# EAGLE design Plytka_AVR (EAGLE 8.2.1)
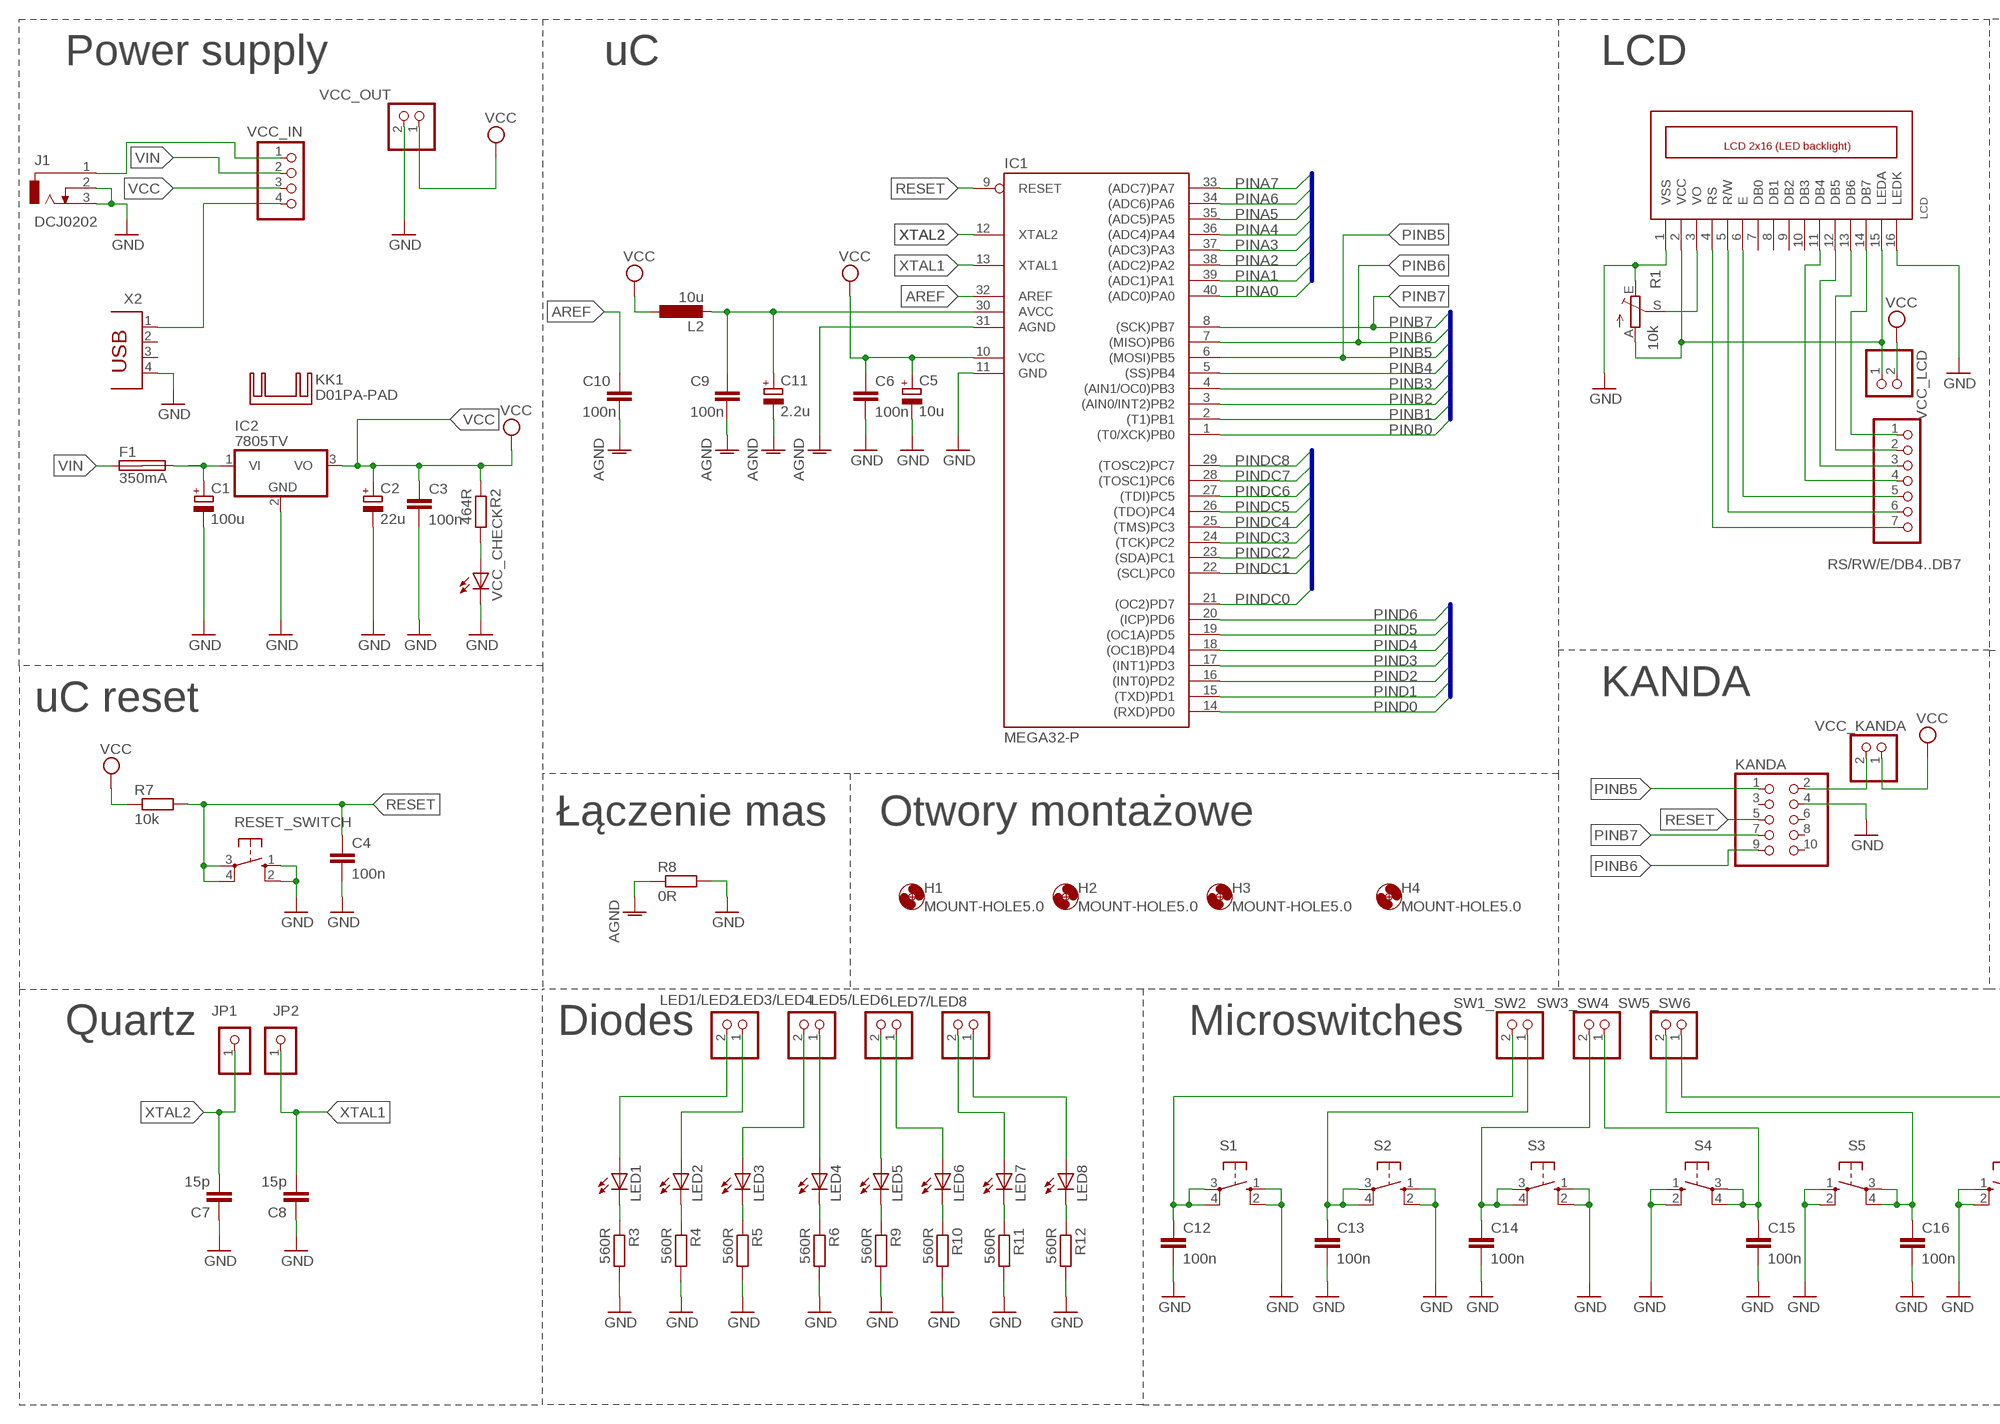
[diagram p0: schematic, sheet 1, part 1 of 2]
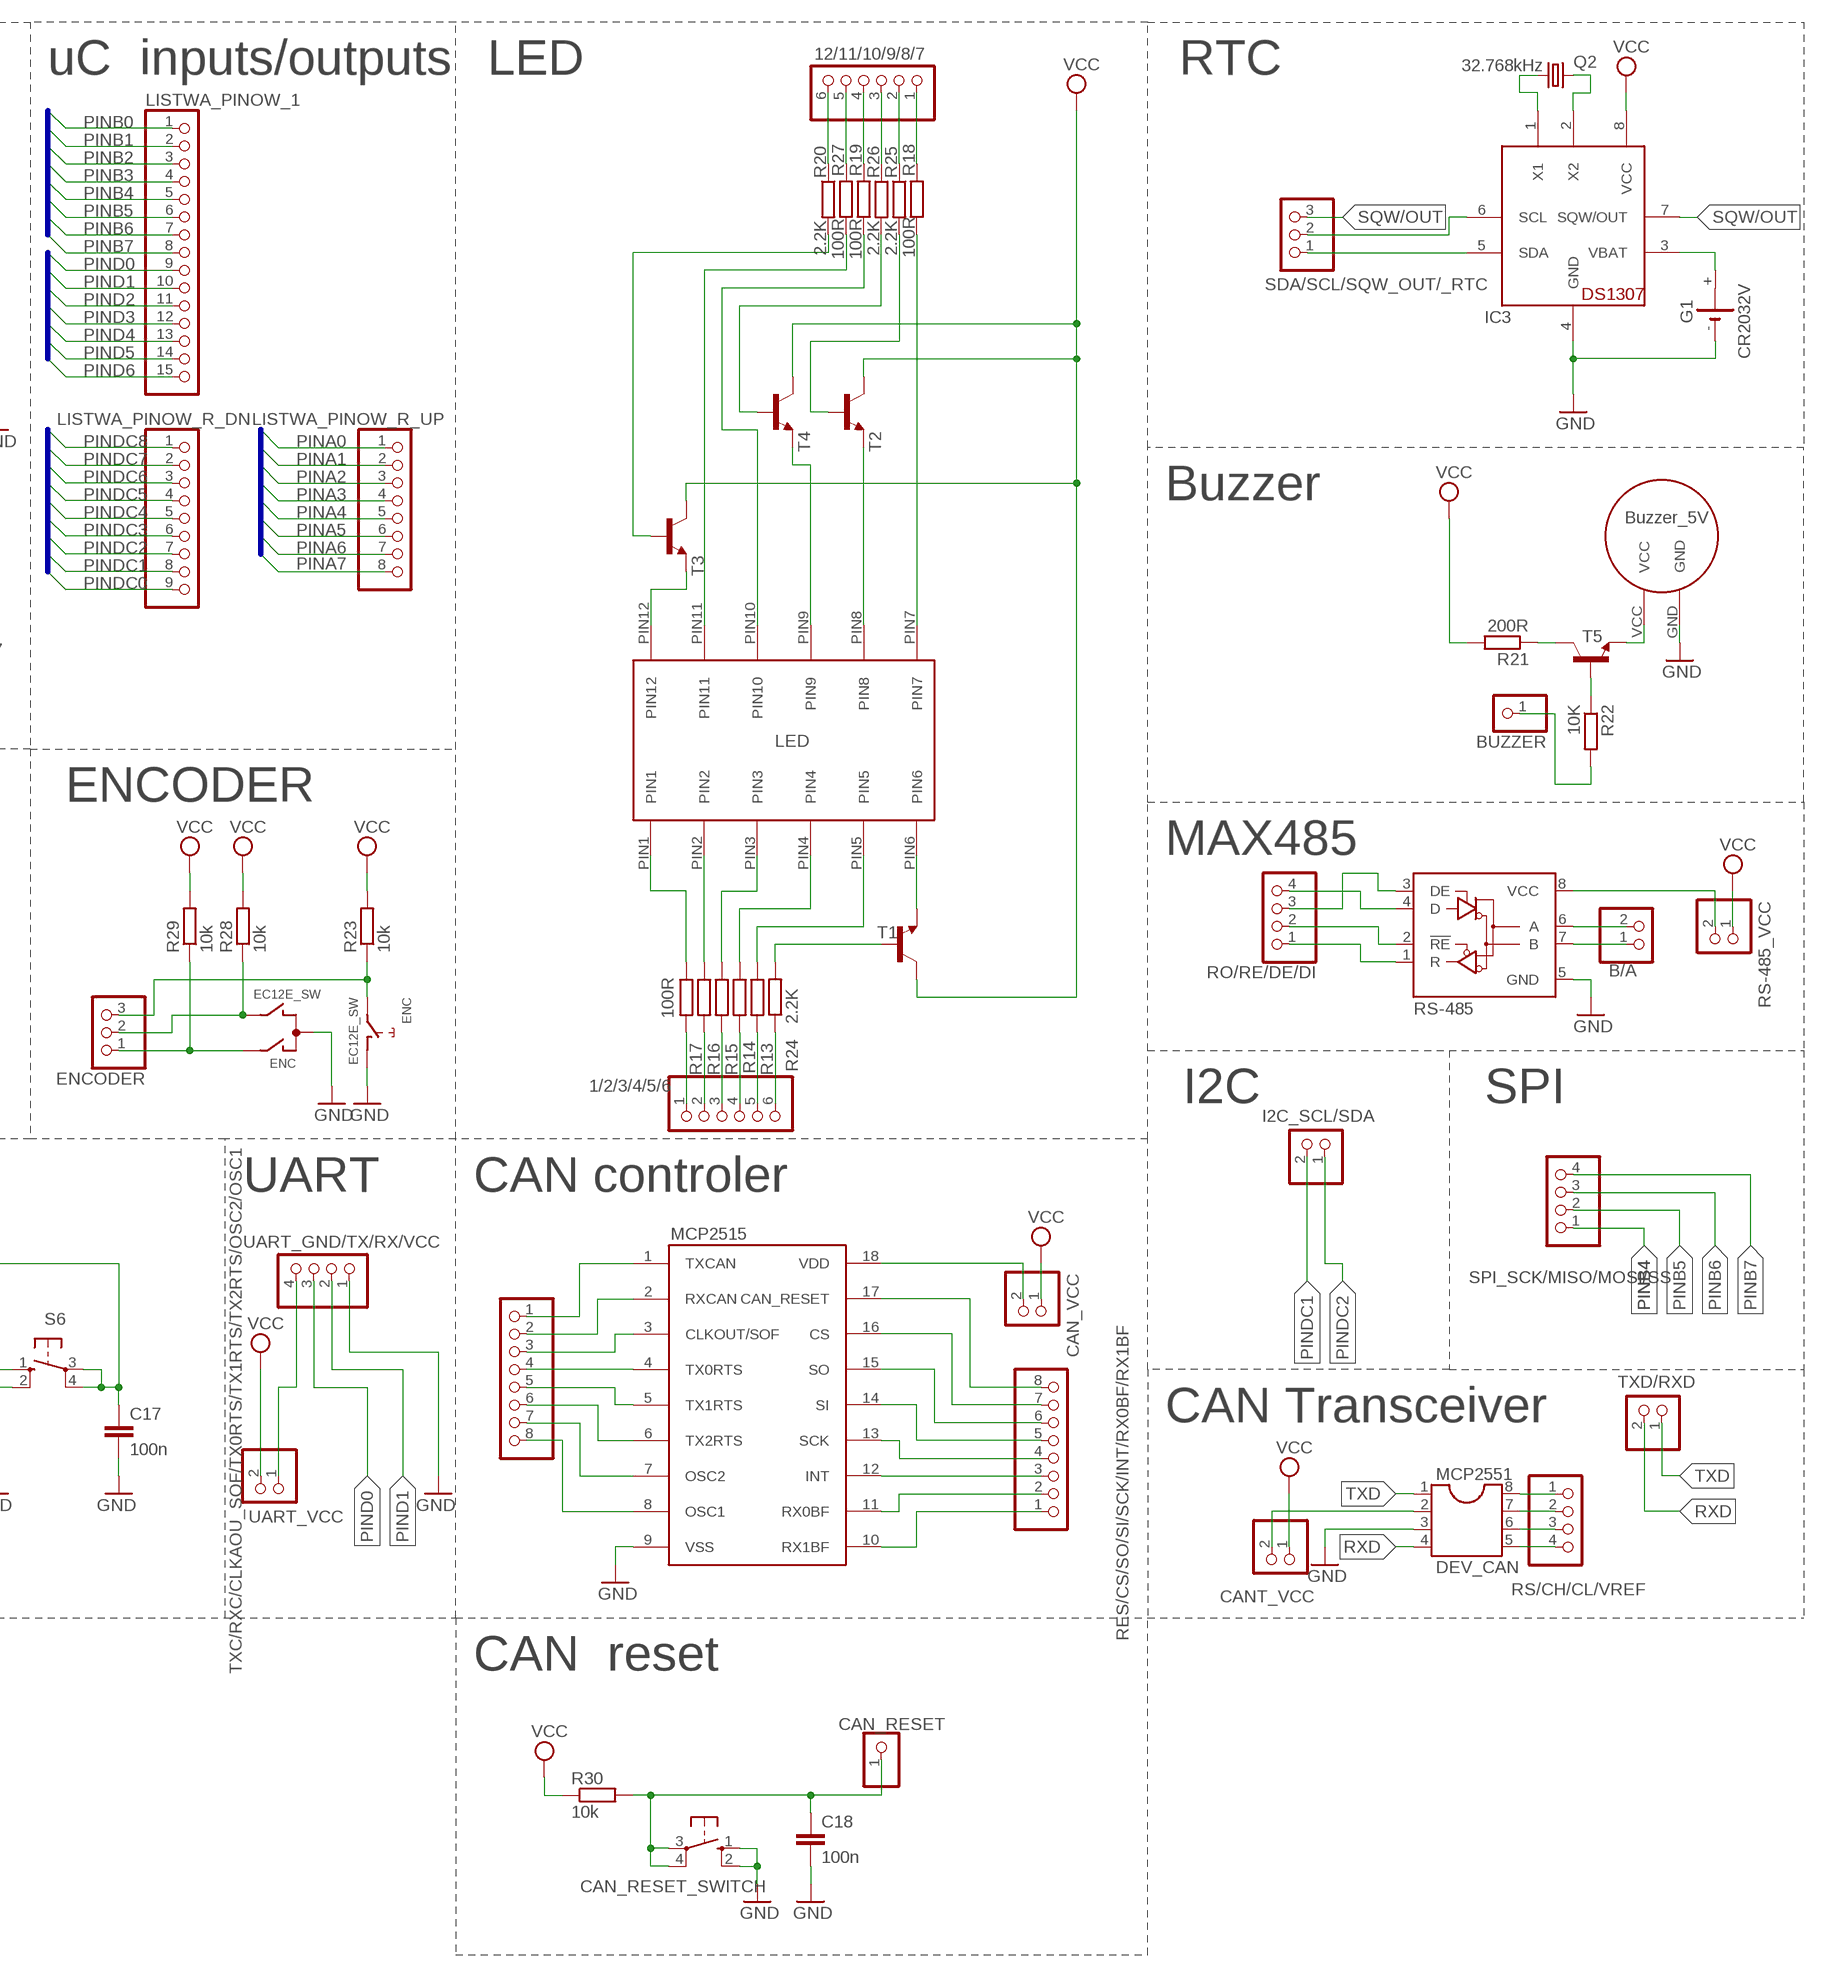
[diagram p1: schematic, sheet 1, part 2 of 2]

## Parts
1/2/3/4/5/6  PINHD-1X6  [1X06]
12/11/10/9/8/7  PINHD-1X6  [1X06]
B/A  PINHD-1X2  [1X02]
BUZZER  PINHD-1X1  [1X01]
C1  100u  CPOL-EUE2.5-6  [E2,5-6]
C2  22u  CPOL-EUE2.5-6  [E2,5-6]
C3  100n  C-EU050-024X044  [C050-024X044]
C4  100n  C-EU050-024X044  [C050-024X044]
C5  10u  CPOL-EUE2.5-6  [E2,5-6]
C6  100n  C-EU050-024X044  [C050-024X044]
C7  15p  C-EU050-024X044  [C050-024X044]
C8  15p  C-EU050-024X044  [C050-024X044]
C9  100n  C-EU050-024X044  [C050-024X044]
C10  100n  C-EU050-024X044  [C050-024X044]
C11  2.2u  CPOL-EUE2.5-6  [E2,5-6]
C12  100n  C-EU050-024X044  [C050-024X044]
C13  100n  C-EU050-024X044  [C050-024X044]
C14  100n  C-EU050-024X044  [C050-024X044]
C15  100n  C-EU050-024X044  [C050-024X044]
C16  100n  C-EU050-024X044  [C050-024X044]
C17  100n  C-EU050-024X044  [C050-024X044]
C18  100n  C-EU050-024X044  [C050-024X044]
CAN_RESET  PINHD-1X1  [1X01]
CAN_RESET_SWITCH  10-XX  [B3F-10XX]
CAN_VCC  PINHD-1X2  [1X02]
CANT_VCC  PINHD-1X2  [1X02]
ENC  EC12E_SW  [ALPS_EC12E_SW]
ENCODER  PINHD-1X3  [1X03]
F1  350mA  SHK20L  [SHK20L]
G1  CR2032V  [CR2032V]
H1  MOUNT-HOLE5.0  [5,0]
H2  MOUNT-HOLE5.0  [5,0]
H3  MOUNT-HOLE5.0  [5,0]
H4  MOUNT-HOLE5.0  [5,0]
I2C_SCL/SDA  PINHD-1X2  [1X02]
IC1  MEGA32-P  [DIL40]
IC2  7805TV  [TO220V]
IC3  DS1307  [DIL08]
J1  DCJ0202  [DCJ0202]
JP1  PINHD-1X1  [1X01]
JP2  PINHD-1X1  [1X01]
KANDA  PINHD-2X5  [2X05]
KK1  D01PA-PAD  [D01PA-PAD]
L2  10u  L-EU0204/7  [0204/7]
LCD  LCD_2X16_SIL  [HY-1602F]
LED1  LED5MM  [LED5MM]
LED1/LED2  PINHD-1X2  [1X02]
LED2  LED5MM  [LED5MM]
LED3  LED5MM  [LED5MM]
LED3/LED4  PINHD-1X2  [1X02]
LED4  LED5MM  [LED5MM]
LED5  LED5MM  [LED5MM]
LED5/LED6  PINHD-1X2  [1X02]
LED6  LED5MM  [LED5MM]
LED7  LED5MM  [LED5MM]
LED7/LED8  PINHD-1X2  [1X02]
LED8  LED5MM  [LED5MM]
LISTWA_PINOW_1  PINHD-1X15  [1X15]
LISTWA_PINOW_R_DN  PINHD-1X9  [1X09]
LISTWA_PINOW_R_UP  PINHD-1X8MAT8  [1X08]
MCP2551  DEV_CAN  [DIL08]
Q2  32.768kHz  CRYSTALTC26V  [TC26V]
R1  10k  TRIM_EU-CA6V  [CA6V]
R2  464R  R-EU_0204/7  [0204/7]
R3  560R  R-EU_0204/7  [0204/7]
R4  560R  R-EU_0204/7  [0204/7]
R5  560R  R-EU_0204/7  [0204/7]
R6  560R  R-EU_0204/7  [0204/7]
R7  10k  R-EU_0204/7  [0204/7]
R8  0R  R-EU_0204/7  [0204/7]
R9  560R  R-EU_0204/7  [0204/7]
R10  560R  R-EU_0204/7  [0204/7]
R11  560R  R-EU_0204/7  [0204/7]
R12  560R  R-EU_0204/7  [0204/7]
R13  100R  R-EU_0204/7  [0204/7]
R14  100R  R-EU_0204/7  [0204/7]
R15  100R  R-EU_0204/7  [0204/7]
R16  100R  R-EU_0204/7  [0204/7]
R17  100R  R-EU_0204/7  [0204/7]
R18  100R  R-EU_0204/7  [0204/7]
R19  100R  R-EU_0204/7  [0204/7]
R20  2.2K  R-EU_0204/7  [0204/7]
R21  200R  R-EU_0204/7  [0204/7]
R22  10K  R-EU_0204/7  [0204/7]
R23  10k  R-EU_0204/7  [0204/7]
R24  2.2K  R-EU_0204/7  [0204/7]
R25  2.2K  R-EU_0204/7  [0204/7]
R26  2.2K  R-EU_0204/7  [0204/7]
R27  100R  R-EU_0204/7  [0204/7]
R28  10k  R-EU_0204/7  [0204/7]
R29  10k  R-EU_0204/7  [0204/7]
R30  10k  R-EU_0204/7  [0204/7]
RES/CS/SO/SI/SCK/INT/RX0BF/RX1BF  PINHD-1X8  [1X08]
RESET_SWITCH  10-XX  [B3F-10XX]
RO/RE/DE/DI  PINHD-1X4  [1X04]
RS-485  RS-485  75176AP  [DIL08]
RS-485_VCC  PINHD-1X2  [1X02]
RS/CH/CL/VREF  PINHD-1X4  [1X04]
RS/RW/E/DB4..DB7  PINHD-1X7MAT_LCD  [1X07]
S1  10-XX  [B3F-10XX]
S2  10-XX  [B3F-10XX]
S3  10-XX  [B3F-10XX]
S4  10-XX  [B3F-10XX]
S5  10-XX  [B3F-10XX]
S6  10-XX  [B3F-10XX]
SDA/SCL/SQW_OUT/_RTC  PINHD-1X3  [1X03]
SPI_SCK/MISO/MOSI/SS  PINHD-1X4  [1X04]
SW1_SW2  PINHD-1X2  [1X02]
SW3_SW4  PINHD-1X2  [1X02]
SW5_SW6  PINHD-1X2  [1X02]
T1  -NPN-TO92  [TO92]
T2  -NPN-TO92  [TO92]
T3  -NPN-TO92  [TO92]
T4  -NPN-TO92  [TO92]
T5  -NPN-TO92  [TO92]
TXC/RXC/CLKAOU_SOF/TX0RTS/TX1RTS/TX2RTS/OSC2/OSC1  PINHD-1X8  [1X08]
TXD/RXD  PINHD-1X2  [1X02]
U$1  LED_MAT  [LED_MOJ]
U$2  BUZZER_MAT  [BUZZER_MAT]
U$3  MCP2515  [DIP18]
UART_GND/TX/RX/VCC  PINHD-1X4  [1X04]
UART_VCC  PINHD-1X2  [1X02]
VCC_CHECK  LED5MM  [LED5MM]
VCC_IN  PINHD-1X4  [1X04]
VCC_KANDA  PINHD-1X2  [1X02]
VCC_LCD  PINHD-1X2  [1X02]
VCC_OUT  PINHD-1X2  [1X02]
X2  PN87520  [PN87520]

## Nets
AGND: C9.2 C10.2 C11.- IC1.31(AGND) R8.1
AREF: C10.1 IC1.32(AREF)
DB4: LCD.11(DB4) RS/RW/E/DB4..DB7.4
DB5: LCD.12(DB5) RS/RW/E/DB4..DB7.3
DB6: LCD.13(DB6) RS/RW/E/DB4..DB7.2
DB7: LCD.14(DB7) RS/RW/E/DB4..DB7.1
E: LCD.6(E) RS/RW/E/DB4..DB7.5
GND: C1.- C2.- C3.2 C4.2 C5.- C6.2 C7.1 C8.1 C12.2 C13.2 C14.2 C15.2 C16.2 C17.2 C18.2 CAN_RESET_SWITCH.1(S) CAN_RESET_SWITCH.2(S1) ENC.C ENC.D G1.- IC1.11(GND) IC2.2(GND) IC3.4(GND) J1.2 J1.3 KANDA.4 LCD.1(VSS) LCD.16(LEDK) MCP2551.3(VDD) R1.E R3.2 R4.2 R5.2 R6.2 R8.2 R9.2 R10.2 R11.2 R12.2 RESET_SWITCH.1(S) RESET_SWITCH.2(S1) RS-485.5(GND) S1.1(S) S1.2(S1) S2.1(S) S2.2(S1) S3.1(S) S3.2(S1) S4.1(S) S4.2(S1) S5.1(S) S5.2(S1) S6.1(S) S6.2(S1) U$2.GND U$3.9(VSS) UART_GND/TX/RX/VCC.1 VCC_CHECK.K(C) VCC_OUT.2 X2.4
N$1: J1.1 VCC_IN.1
N$2: VCC_IN.4 X2.1
N$3: T1.1(E) U$1.PIN6
N$4: R2.2 VCC_CHECK.A
N$5: C9.1 C11.+ IC1.30(AVCC) L2.2
N$6: MCP2551.8(RS) RS/CH/CL/VREF.1
N$7: 12/11/10/9/8/7.6 R20.1
N$8: 1/2/3/4/5/6.1 R17.2
N$9: 1/2/3/4/5/6.2 R16.2
N$10: 1/2/3/4/5/6.3 R15.2
N$11: 1/2/3/4/5/6.4 R14.2
N$12: 1/2/3/4/5/6.5 R13.2
N$13: R17.1 U$1.PIN1
N$14: R27.1 U$1.PIN11
N$15: LED1.K(C) R3.1
N$16: LED1.A LED1/LED2.2
N$17: 12/11/10/9/8/7.4 R19.2
N$18: R18.1 U$1.PIN7
N$19: R16.1 U$1.PIN2
N$20: R15.1 U$1.PIN3
N$21: R14.1 U$1.PIN4
N$22: R13.1 U$1.PIN5
N$23: 12/11/10/9/8/7.1 R18.2
N$24: 12/11/10/9/8/7.2 R25.1
N$25: T2.1(E) U$1.PIN8
N$26: 1/2/3/4/5/6.6 R24.1
N$27: LED1/LED2.1 LED2.A
N$28: LED3.A LED3/LED4.2
N$29: LED5/LED6.1 LED6.A
N$30: LED5.K(C) R9.1
N$31: LED2.K(C) R4.1
N$32: LED6.K(C) R10.1
N$33: LED3.K(C) R5.1
N$34: LED7.K(C) R11.1
N$35: LED4.K(C) R6.1
N$36: LED8.K(C) R12.1
N$37: LED5.A LED5/LED6.2
N$38: MCP2551.7(CANH) RS/CH/CL/VREF.2
N$39: LED7/LED8.1 LED8.A
N$40: C18.1 CAN_RESET.1 CAN_RESET_SWITCH.3(P) CAN_RESET_SWITCH.4(P1) R30.2
N$41: LCD.3(VO) R1.S
N$42: KANDA.2 VCC_KANDA.2
N$43: MCP2551.6(CANL) RS/CH/CL/VREF.3
N$44: MCP2551.5(VREF) RS/CH/CL/VREF.4
N$46: R24.2 T1.2(B)
N$49: R25.2 T2.2(B)
N$50: T4.1(E) U$1.PIN9
N$51: 12/11/10/9/8/7.3 R26.1
N$52: IC3.6(SCL) SDA/SCL/SQW_OUT/_RTC.2
N$53: R26.2 T4.2(B)
N$54: IC3.5(SDA) SDA/SCL/SQW_OUT/_RTC.1
N$55: R19.1 U$1.PIN10
N$56: 12/11/10/9/8/7.5 R27.2
N$57: IC3.1(X1) Q2.1
N$58: R20.2 T3.2(B)
N$59: T3.1(E) U$1.PIN12
N$60: IC3.2(X2) Q2.2
N$61: G1.+ IC3.3(VBAT)
N$62: T5.1(E) U$2.VCC
N$63: R21.1 T5.3(C)
N$64: R22.1 T5.2(B)
N$65: BUZZER.1 R22.2
N$68: RO/RE/DE/DI.4 RS-485.4(D)
N$69: RO/RE/DE/DI.3 RS-485.3(DE)
N$70: RO/RE/DE/DI.2 RS-485.2(!RE)
N$71: RO/RE/DE/DI.1 RS-485.1(R)
N$72: B/A.2 RS-485.6(A)
N$73: B/A.1 RS-485.7(B)
N$74: ENC.B ENCODER.2 R28.1
N$75: ENC.A ENCODER.1 R29.1
N$76: CAN_VCC.2 U$3.18(VDD)
N$77: ENC.E ENCODER.3 R23.1
N$78: RES/CS/SO/SI/SCK/INT/RX0BF/RX1BF.1 U$3.10(RX1BF)
N$79: RES/CS/SO/SI/SCK/INT/RX0BF/RX1BF.2 U$3.11(RX0BF)
N$80: RES/CS/SO/SI/SCK/INT/RX0BF/RX1BF.3 U$3.12(INT)
N$81: RES/CS/SO/SI/SCK/INT/RX0BF/RX1BF.4 U$3.13(SCK)
N$82: RES/CS/SO/SI/SCK/INT/RX0BF/RX1BF.5 U$3.14(SI)
N$83: RES/CS/SO/SI/SCK/INT/RX0BF/RX1BF.6 U$3.15(SO)
N$84: RES/CS/SO/SI/SCK/INT/RX0BF/RX1BF.7 U$3.16(CS)
N$85: RES/CS/SO/SI/SCK/INT/RX0BF/RX1BF.8 U$3.17(CAN_RESET)
N$86: TXC/RXC/CLKAOU_SOF/TX0RTS/TX1RTS/TX2RTS/OSC2/OSC1.8 U$3.8(OSC1)
N$87: TXC/RXC/CLKAOU_SOF/TX0RTS/TX1RTS/TX2RTS/OSC2/OSC1.7 U$3.7(OSC2)
N$88: TXC/RXC/CLKAOU_SOF/TX0RTS/TX1RTS/TX2RTS/OSC2/OSC1.6 U$3.6(TX2RTS)
N$89: TXC/RXC/CLKAOU_SOF/TX0RTS/TX1RTS/TX2RTS/OSC2/OSC1.5 U$3.5(TX1RTS)
N$90: TXC/RXC/CLKAOU_SOF/TX0RTS/TX1RTS/TX2RTS/OSC2/OSC1.4 U$3.4(TX0RTS)
N$91: TXC/RXC/CLKAOU_SOF/TX0RTS/TX1RTS/TX2RTS/OSC2/OSC1.3 U$3.3(CLKOUT/SOF)
N$92: TXC/RXC/CLKAOU_SOF/TX0RTS/TX1RTS/TX2RTS/OSC2/OSC1.2 U$3.2(RXCAN)
N$93: TXC/RXC/CLKAOU_SOF/TX0RTS/TX1RTS/TX2RTS/OSC2/OSC1.1 U$3.1(TXCAN)
N$100: UART_GND/TX/RX/VCC.4 UART_VCC.1
N$101: CANT_VCC.2 MCP2551.2(VSS)
N$102: C1.+ F1.2A IC2.1(VI)
N$103: RS-485.8(VCC) RS-485_VCC.2
N$104: LED3/LED4.1 LED4.A
N$105: LED7.A LED7/LED8.2
N$106: LCD.2(VCC) LCD.15(LEDA) R1.A VCC_LCD.1
PINA0: IC1.40((ADC0)PA0) LISTWA_PINOW_R_UP.1
PINA1: IC1.39((ADC1)PA1) LISTWA_PINOW_R_UP.2
PINA2: IC1.38((ADC2)PA2) LISTWA_PINOW_R_UP.3
PINA3: IC1.37((ADC3)PA3) LISTWA_PINOW_R_UP.4
PINA4: IC1.36((ADC4)PA4) LISTWA_PINOW_R_UP.5
PINA5: IC1.35((ADC5)PA5) LISTWA_PINOW_R_UP.6
PINA6: IC1.34((ADC6)PA6) LISTWA_PINOW_R_UP.7
PINA7: IC1.33((ADC7)PA7) LISTWA_PINOW_R_UP.8
PINB0: IC1.1((T0/XCK)PB0) LISTWA_PINOW_1.1
PINB1: IC1.2((T1)PB1) LISTWA_PINOW_1.2
PINB2: IC1.3((AIN0/INT2)PB2) LISTWA_PINOW_1.3
PINB3: IC1.4((AIN1/OC0)PB3) LISTWA_PINOW_1.4
PINB4: IC1.5((SS)PB4) LISTWA_PINOW_1.5 SPI_SCK/MISO/MOSI/SS.1
PINB5: IC1.6((MOSI)PB5) KANDA.1 LISTWA_PINOW_1.6 SPI_SCK/MISO/MOSI/SS.2
PINB6: IC1.7((MISO)PB6) KANDA.9 LISTWA_PINOW_1.7 SPI_SCK/MISO/MOSI/SS.3
PINB7: IC1.8((SCK)PB7) KANDA.7 LISTWA_PINOW_1.8 SPI_SCK/MISO/MOSI/SS.4
PIND0: IC1.14((RXD)PD0) LISTWA_PINOW_1.9 UART_GND/TX/RX/VCC.3
PIND1: IC1.15((TXD)PD1) LISTWA_PINOW_1.10 UART_GND/TX/RX/VCC.2
PIND2: IC1.16((INT0)PD2) LISTWA_PINOW_1.11
PIND3: IC1.17((INT1)PD3) LISTWA_PINOW_1.12
PIND4: IC1.18((OC1B)PD4) LISTWA_PINOW_1.13
PIND5: IC1.19((OC1A)PD5) LISTWA_PINOW_1.14
PIND6: IC1.20((ICP)PD6) LISTWA_PINOW_1.15
PINDC0: IC1.21((OC2)PD7) LISTWA_PINOW_R_DN.9
PINDC1: I2C_SCL/SDA.2 IC1.22((SCL)PC0) LISTWA_PINOW_R_DN.8
PINDC2: I2C_SCL/SDA.1 IC1.23((SDA)PC1) LISTWA_PINOW_R_DN.7
PINDC3: IC1.24((TCK)PC2) LISTWA_PINOW_R_DN.6
PINDC4: IC1.25((TMS)PC3) LISTWA_PINOW_R_DN.5
PINDC5: IC1.26((TDO)PC4) LISTWA_PINOW_R_DN.4
PINDC6: IC1.27((TDI)PC5) LISTWA_PINOW_R_DN.3
PINDC7: IC1.28((TOSC1)PC6) LISTWA_PINOW_R_DN.2
PINDC8: IC1.29((TOSC2)PC7) LISTWA_PINOW_R_DN.1
R/W: LCD.5(R/W) RS/RW/E/DB4..DB7.6
RESET: C4.1 IC1.9(RESET) KANDA.5 R7.2 RESET_SWITCH.3(P) RESET_SWITCH.4(P1)
RS: LCD.4(RS) RS/RW/E/DB4..DB7.7
RXD: MCP2551.4(RXD) TXD/RXD.2
SQW/OUT: IC3.7(SQW/OUT) SDA/SCL/SQW_OUT/_RTC.3
SWITCH1: C12.1 S1.3(P) S1.4(P1) SW1_SW2.2
SWITCH5: C13.1 S2.3(P) S2.4(P1) SW1_SW2.1
SWITCH6: C14.1 S3.3(P) S3.4(P1) SW3_SW4.2
SWITCH7: C15.1 S4.3(P) S4.4(P1) SW3_SW4.1
SWITCH8: C16.1 S5.3(P) S5.4(P1) SW5_SW6.2
SWITCH9: C17.1 S6.3(P) S6.4(P1) SW5_SW6.1
TXD: MCP2551.1(TXD) TXD/RXD.1
VCC: C2.+ C3.1 C5.+ C6.1 CAN_VCC.1 CANT_VCC.1 IC1.10(VCC) IC2.3(VO) IC3.8(VCC) L2.1 R2.1 R7.1 R21.2 R23.2 R28.2 R29.2 R30.1 RS-485_VCC.1 T1.3(C) T2.3(C) T3.3(C) T4.3(C) UART_VCC.2 VCC_IN.3 VCC_KANDA.1 VCC_LCD.2 VCC_OUT.1
VIN: F1.1A VCC_IN.2
XTAL1: C8.2 IC1.13(XTAL1) JP2.1
XTAL2: C7.2 IC1.12(XTAL2) JP1.1
Unconnected: ENC.GND1(G) ENC.GND2(G) F1.1B F1.2B G1.+@1(+) KANDA.3 KANDA.6 KANDA.8 KANDA.10 LCD.7(DB0) LCD.8(DB1) LCD.9(DB2) LCD.10(DB3) X2.2 X2.3

## Buses
PINB[0..7]
PIND[0..6]
PINDC[0..8]
PINA[0..7]

## Notes on the sheet
- Power supply | uC | LCD | uC  inputs/outputs | LED | RTC
- Buzzer
- KANDA | ENCODER
- uC reset
- MAX485
- Łączenie mas | Otwory montażowe
- I2C | SPI
- Quartz | Diodes | Microswitches | UART | CAN controler
- CAN Transceiver
- CAN  reset

## Library data of the parts
1/2/3/4/5/6 12/11/10/9/8/7 = pinheadMateusz_popr:PINHD-1X6: PIN HEADER
B/A CAN_VCC CANT_VCC I2C_SCL/SDA LED1/LED2 LED3/LED4 LED5/LED6 LED7/LED8 RS-485_VCC SW1_SW2 SW3_SW4 SW5_SW6 TXD/RXD UART_VCC VCC_KANDA VCC_LCD VCC_OUT = pinheadMateusz_popr:PINHD-1X2: PIN HEADER
BUZZER CAN_RESET JP1 JP2 = pinheadMateusz_popr:PINHD-1X1: PIN HEADER
C1 C2 C5 C11 = rcl:CPOL-EU: POLARIZED CAPACITOR, European symbol
C3 C4 C6-C10 C12-C18 = rcl:C-EU: CAPACITOR, European symbol
CAN_RESET_SWITCH RESET_SWITCH S1-S6 = switch-omron:10-XX: OMRON SWITCH; MPN: B3F-1000; OC_FARNELL: 176432; OC_NEWARK: 36M3542
ENC = switch-alps:EC12E_SW: ALPS rotary Encoder EC12E series with switch; MPN: EC12E2424407; OC_FARNELL: 1520813; OC_NEWARK: 74M1068
ENCODER SDA/SCL/SQW_OUT/_RTC = pinheadMateusz_popr:PINHD-1X3: PIN HEADER
F1 = fuse:SHK20L: FUSE HOLDER 5 x 20 mm, SH contact, SHH1 Schukat, E1073 Buerklin; OC_FARNELL: unknown; OC_NEWARK: unknown
G1 = battery:CR2032V: LI BATTERY Varta
H1-H4 = holes:MOUNT-HOLE: MOUNTING HOLE with drill center marker
IC1 = MATatmel:MEGA32-P: MICROCONTROLLER 32 Kbytes FLASH 2 Kbytes SRAM 1 Kbytes EEPROM USART 8-channel 10 bit ADC Source: www.atmel.com .. doc2503.pdf; MPN: ATMEGA32-16PU; OC_FARNELL: 1661729; OC_NEWARK: 51P1794
IC2 = linear:78*: Positive VOLTAGE REGULATOR Source: http://cache.national.com/ds/LM/LM78L05.pdf http://www.fairchildsemi.com/ds/LM/LM7805.pdf
IC3 = adafruit:DS1307: DS1307 Real time clock (RTC) with battery backup ability. Talk to it via i2c
J1 = con-jackMAT:DCJ0202: DC POWER JACK Source: DCJ0202.pdf; OC_FARNELL: unknown; OC_NEWARK: unknown
KANDA = pinhead:PINHD-2X5: PIN HEADER
KK1 = heatsink:D01PA-PAD: HEATSINK distributor Schukat
L2 = rcl:L-EU: INDUCTOR, European symbol
LCD = lcd_2x16_led_backlight:LCD_2X16_SIL
LED1-LED8 VCC_CHECK = led:LED: LED OSRAM: - CHIPLED LG R971, LG N971, LY N971, LG Q971, LY Q971, LO R971, LY R971 LH N974, LH R974 LS Q976, LO Q976, LY Q976 LO Q996 - Hyper CHIPLED LW Q18S LB Q993, LB Q99A, LB R99A - SideLED LS A670, LO A670, LY A670, LG A670, LP A670 LB A673, LV A673, LT A673, LW A673 LH A674 LY A675 LS A676, LA A676, LO A676, LY A676, LW A676 LS A679, LY A679, LG A679 - Hyper Micro SIDELED® LS Y876, LA Y876, LO Y876, LY Y876 LT Y87S - SmartLED LW L88C, LW L88S LB L89C, LB L89S, LG L890 LS L89K, LO L89K, LY L89K LS L896, LA L896, LO L896, LY L896 - TOPLED LS T670, LO T670, LY T670, LG T670, LP T670 LSG T670, LSP T670, LSY T670, LOP T670, LYG T670 LG T671, LOG T671, LSG T671 LB T673, LV T673, LT T673, LW T673 LH T674 LS T676, LA T676, LO T676, LY T676, LB T676, LH T676, LSB T676, LW T676 LB T67C, LV T67C, LT T67C, LS T67K, LO T67K, LY T67K, LW E67C LS E67B, LA E67B, LO E67B, LY E67B, LB E67C, LV E67C, LT E67C LW T67C LS T679, LY T679, LG T679 LS T770, LO T770, LY T770, LG T770, LP T770 LB T773, LV T773, LT T773, LW T773 LH T774 LS E675, LA E675, LY E675, LS T675 LS T776, LA T776, LO T776, LY T776, LB T776 LHGB T686 LT T68C, LB T68C - Hyper Mini TOPLED® LB M676 - Mini TOPLED Santana® LG M470 LS M47K, LO M47K, LY M47K Source: http://www.osram.convergy.de LUXEON: - LUMILED® LXK2-PW12-R00, LXK2-PW12-S00, LXK2-PW14-U00, LXK2-PW14-V00 LXK2-PM12-R00, LXK2-PM12-S00, LXK2-PM14-U00 LXK2-PE12-Q00, LXK2-PE12-R00, LXK2-PE12-S00, LXK2-PE14-T00, LXK2-PE14-U00 LXK2-PB12-K00, LXK2-PB12-L00, LXK2-PB12-M00, LXK2-PB14-N00, LXK2-PB14-P00, LXK2-PB14-Q00 LXK2-PR12-L00, LXK2-PR12-M00, LXK2-PR14-Q00, LXK2-PR14-R00 LXK2-PD12-Q00, LXK2-PD12-R00, LXK2-PD12-S00 LXK2-PH12-R00, LXK2-PH12-S00 LXK2-PL12-P00, LXK2-PL12-Q00, LXK2-PL12-R00 Source: www.luxeon.com KINGBRIGHT: KA-3528ASYC Source: www.kingbright.com
LISTWA_PINOW_1 = pinheadMateusz_popr:PINHD-1X15: PIN HEADER
LISTWA_PINOW_R_DN = pinheadMateusz_popr:PINHD-1X9: PIN HEADER
LISTWA_PINOW_R_UP RES/CS/SO/SI/SCK/INT/RX0BF/RX1BF TXC/RXC/CLKAOU_SOF/TX0RTS/TX1RTS/TX2RTS/OSC2/OSC1 = pinheadMateusz_popr:PINHD-1X8: PIN HEADER
MCP2551 = ic-packageMat:DEV_CAN
Q2 = crystal:CRYSTAL: CRYSTAL; OC_FARNELL: unknown; OC_NEWARK: unknown
R1 = pot:TRIM_EU-: POTENTIOMETER
R2-R30 = rcl:R-EU_: RESISTOR, European symbol
RO/RE/DE/DI RS/CH/CL/VREF SPI_SCK/MISO/MOSI/SS UART_GND/TX/RX/VCC VCC_IN = pinheadMateusz_popr:PINHD-1X4: PIN HEADER
RS-485 = 751xx:75176A: DIFFERENTIAL BUS TRANSCEIVER Source: http://focus.ti.com/lit/ds/symlink/sn75176a.pdf
RS/RW/E/DB4..DB7 = pinheadMateusz_popr:PINHD-1X7: PIN HEADER
T1-T5 = transistor:*-NPN-: NPN Transistror BF959 corrected 2008.03.06
U$1 = LED_MAT:LED_MAT
U$2 = buzzer:BUZZER_MAT
U$3 = magnevation-speakjet:MCP2515
X2 = con-berg_poprw:PN87520: BERG USB connector; OC_FARNELL: unknown; OC_NEWARK: unknown

## Board
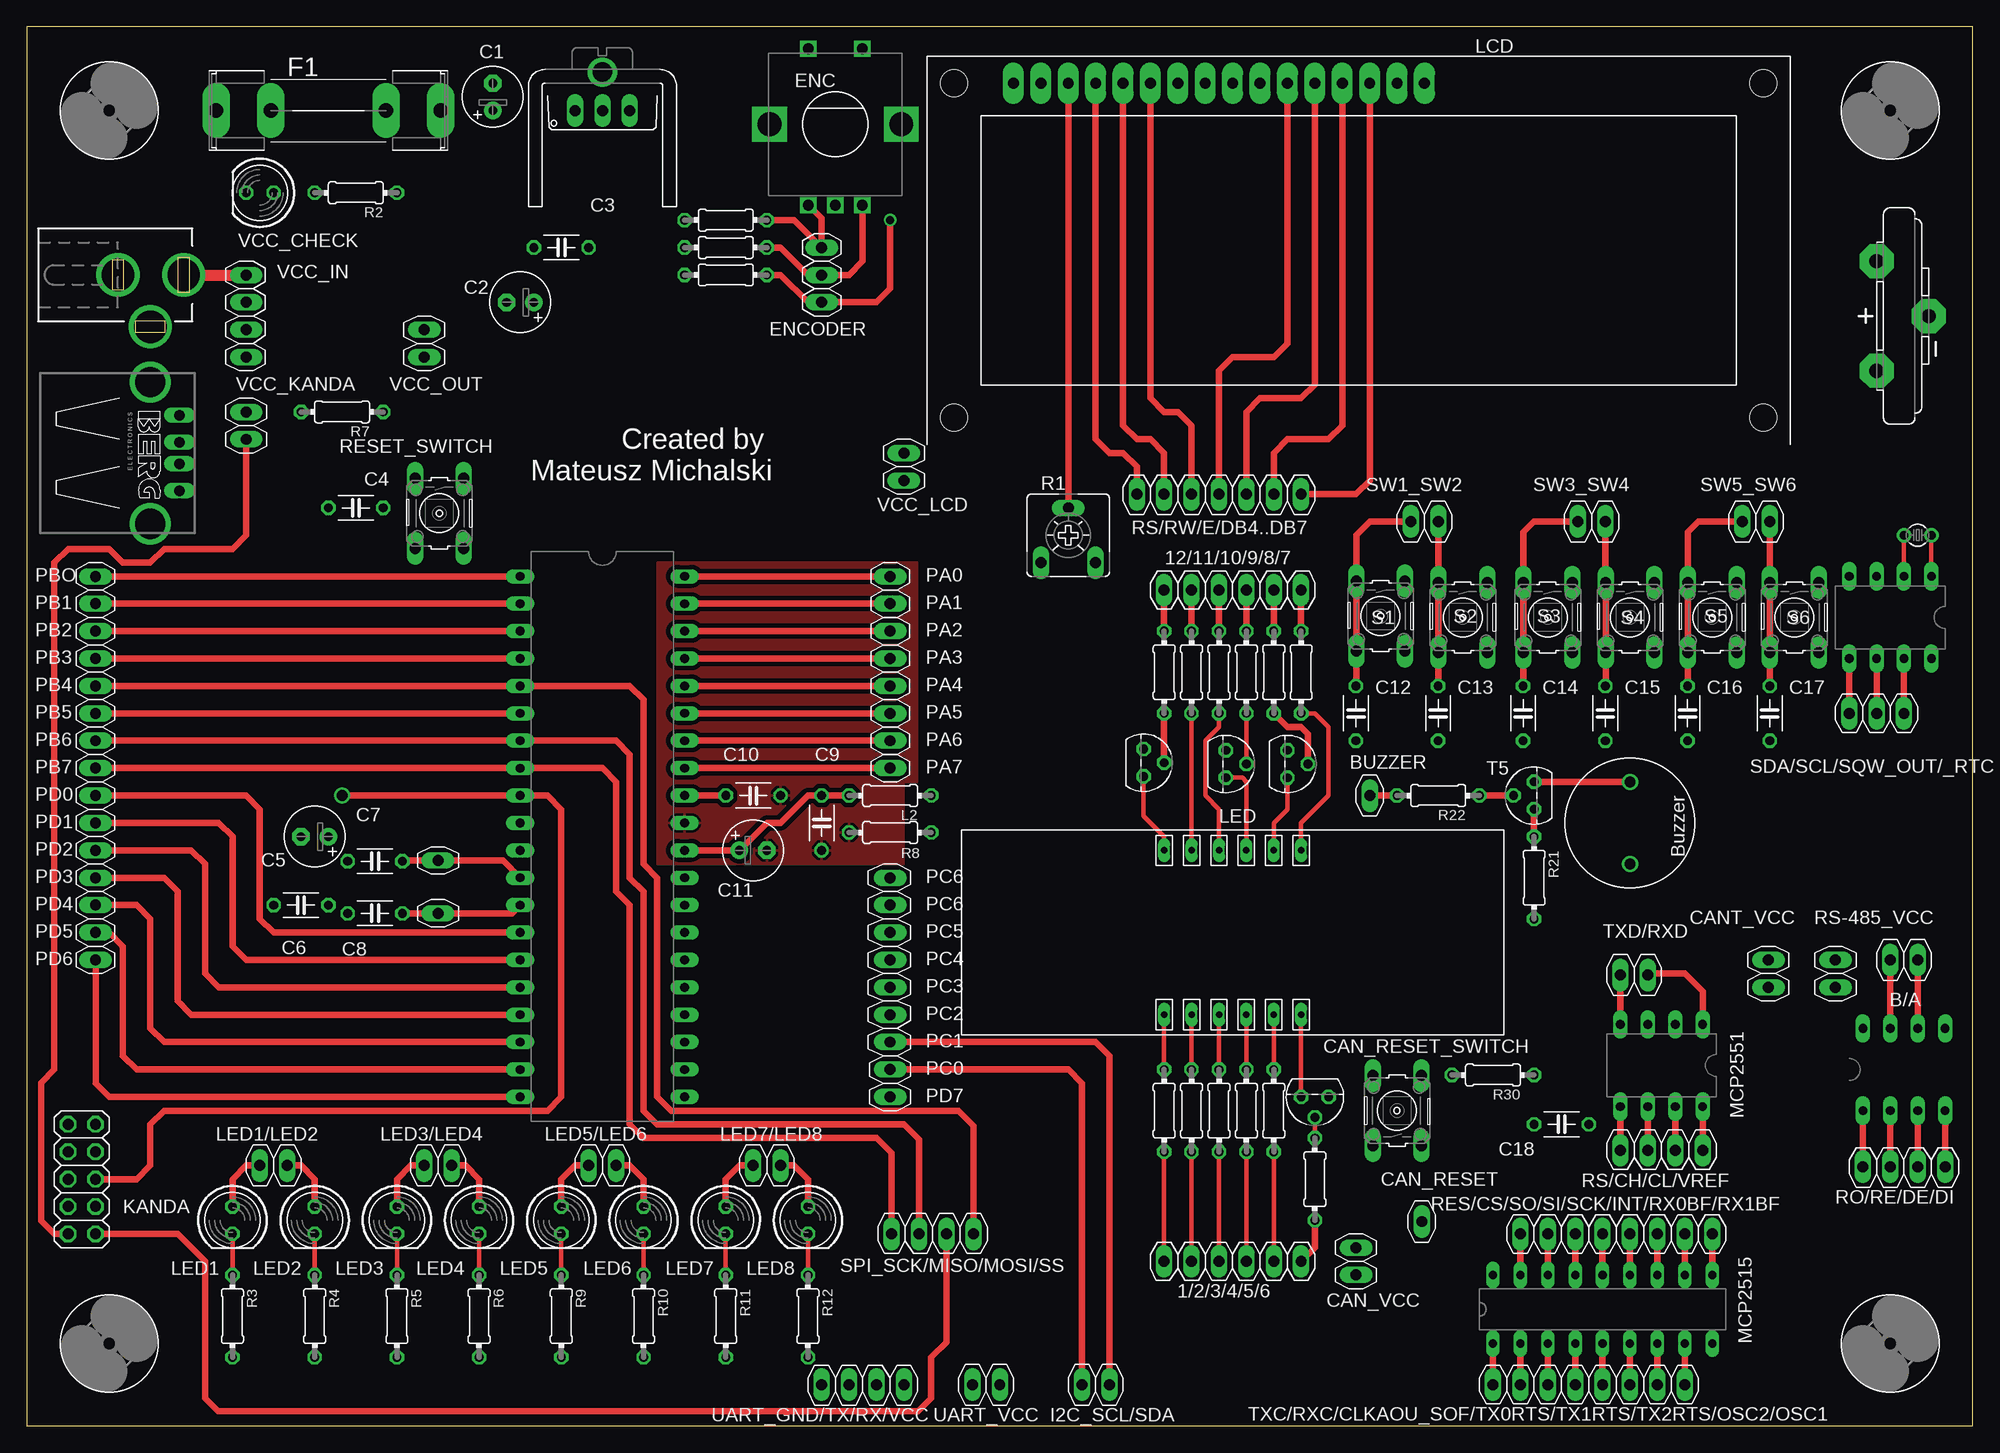
[diagram p2: board, top side]
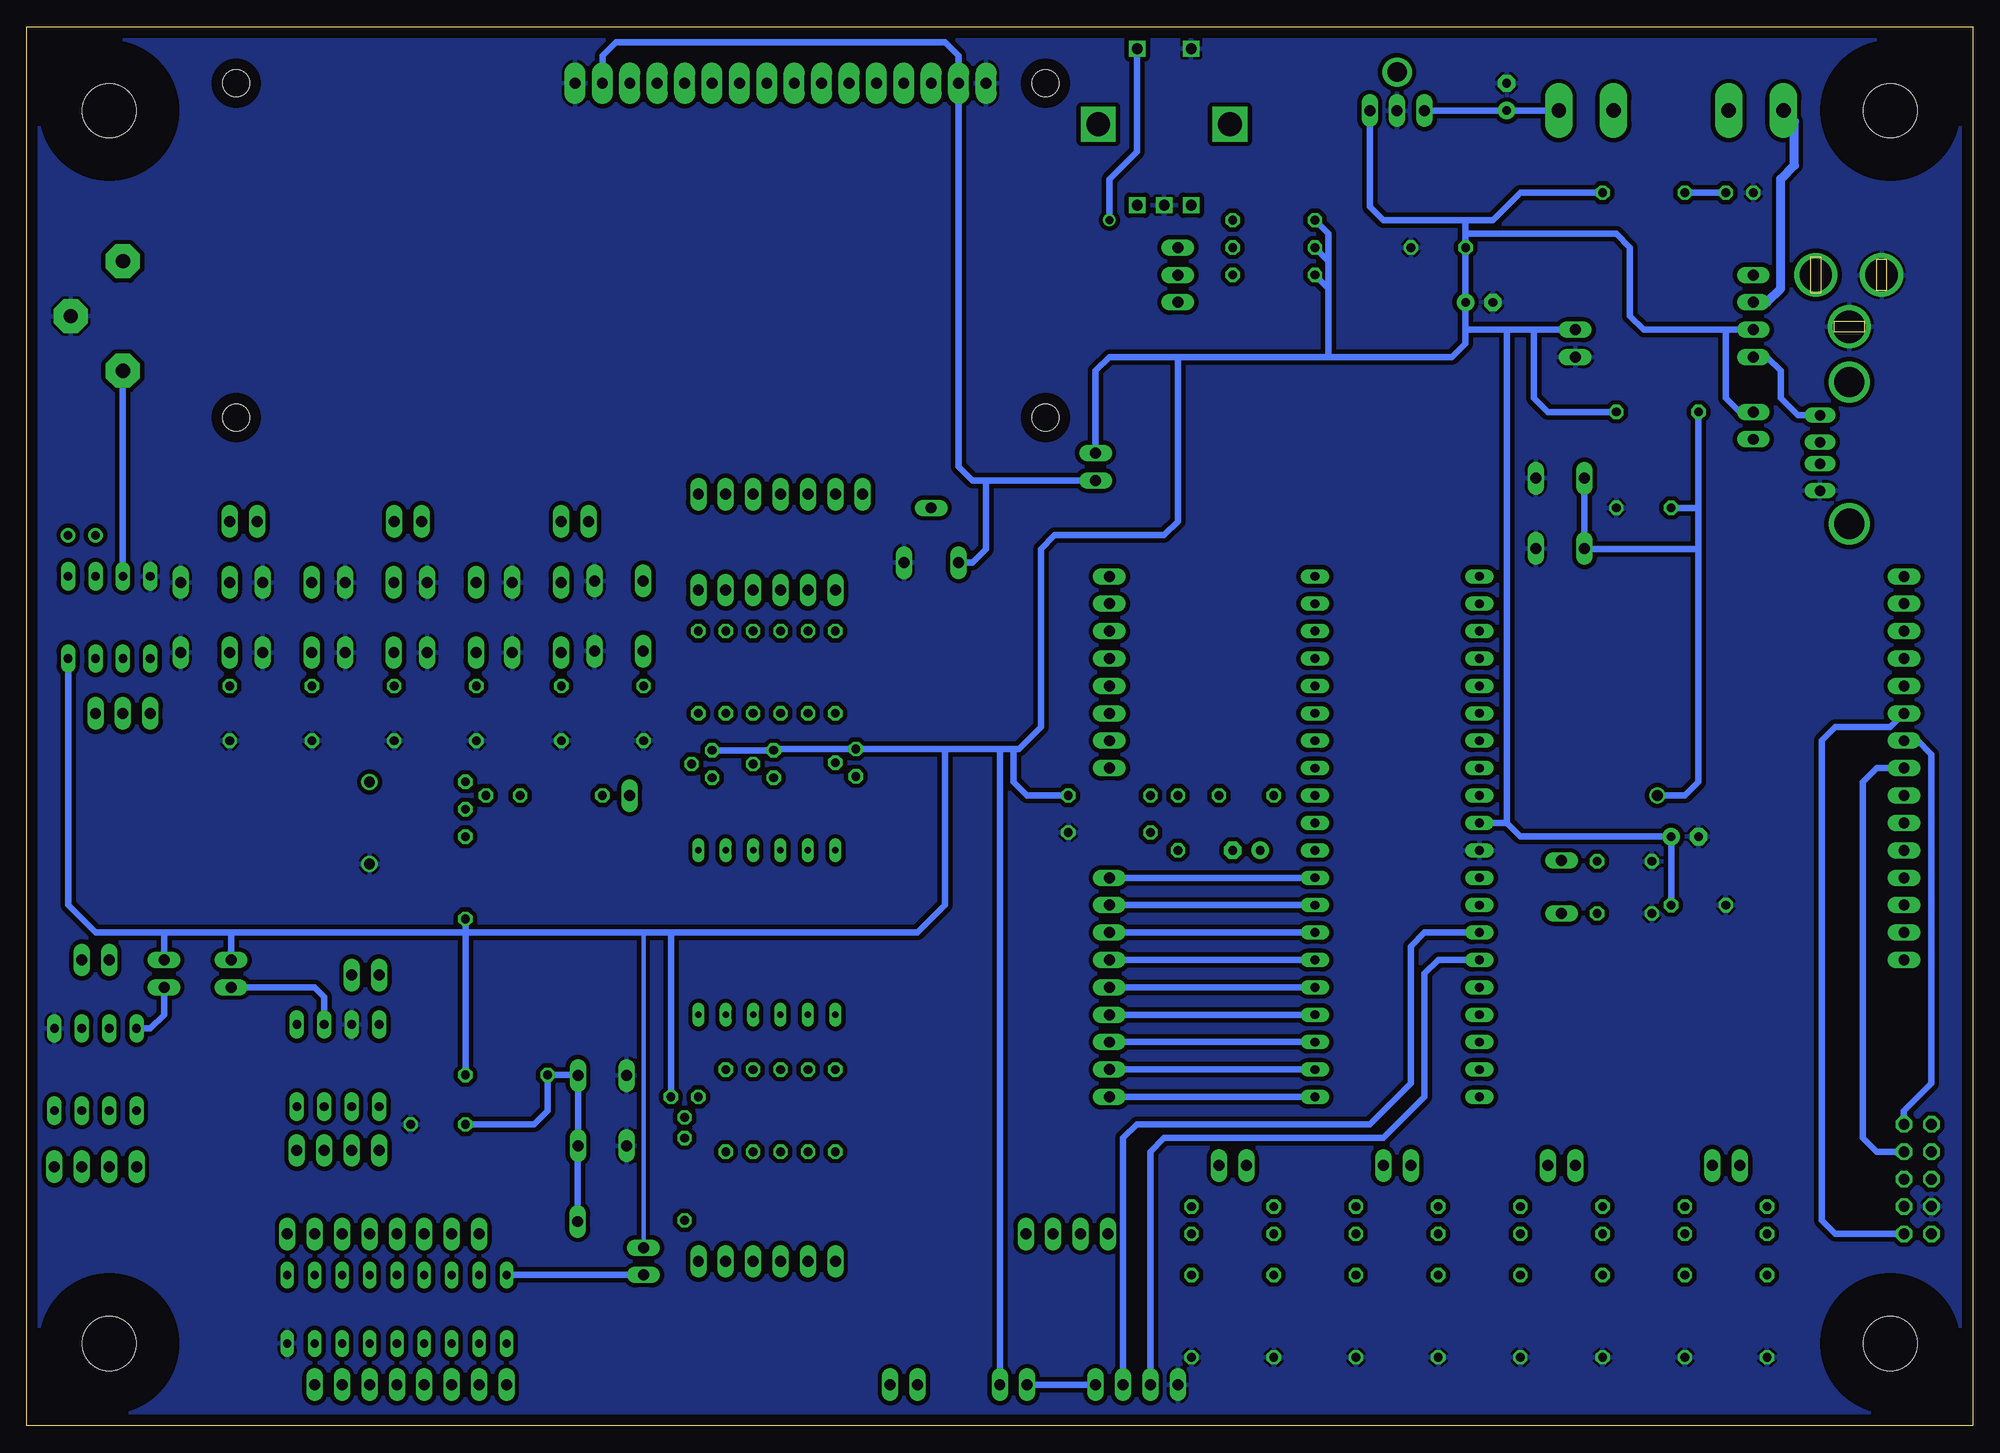
[diagram p3: board, bottom side, seen from below]

Size 180.34 x 129.67 mm. Coordinates in mm from the lower left corner, seen from the top.
Outline: 0,0 180.34,0 180.34,129.67 0,129.67 0,0
Copper layers (1*16): Top 0.035mm / dielectric 1.5mm / Bottom 0.035mm
Design rules "default *": minimum track width 8mil, minimum drill 0.35mm, track to track 6mil, track to pad 6mil, pad to pad 6mil, via to via 6mil, smd to smd 6mil, copper to edge 40mil, drill to drill 6mil, minimum pad ring 10mil, minimum via ring 8mil, stop-mask expansion 4mil, vias tented up to drill 0mil, thermal gap 10mil

### Footprints (pad centres in the part's own frame; a part is rotated, then mirrored left to right if it is on the bottom)
1X06 = drill 1.016 long: 1 -6.35,0; 2 -3.81,0; 3 -1.27,0; 4 1.27,0; 5 3.81,0; 6 6.35,0
1X02 = drill 1.016 long: 1 -1.27,0; 2 1.27,0
1X01 = drill 1.016 long: 1 0,0
E2,5-6 = drill 0.813 pad 1.6: + -1.27,0 | drill 0.813 pad 1.6 octagon: - 1.27,0
C050-024X044 = drill 0.813 octagon: 1 -2.54,0; 2 2.54,0
B3F-10XX = drill 1.016 long: 1 -3.251,2.261; 2 3.251,2.261; 3 -3.251,-2.261; 4 3.251,-2.261
ALPS_EC12E_SW = drill 1 square: A -2.5,-7.5; B 2.5,-7.5; C 0,-7.5; D -2.5,7; E 2.5,7 | drill 2.2 square: GND1 -6.1,0; GND2 6.1,0
1X03 = drill 1.016 long: 1 -2.54,0; 2 0,0; 3 2.54,0
SHK20L = drill 1.321 pad 2.54 long: 1A -10.414,0; 1B -5.334,0; 2A 10.414,0; 2B 5.334,0
CR2032V = drill 1.321 pad 3.15 octagon: + -2.54,-5.08; +@1 -2.54,5.08; - 2.286,0
5,0 = hole 5: 0,0
DIL40 = drill 0.813 long: 1 -24.13,-7.62; 2 -21.59,-7.62; 3 -19.05,-7.62; 4 -16.51,-7.62; 5 -13.97,-7.62; 6 -11.43,-7.62; 7 -8.89,-7.62; 8 -6.35,-7.62; 9 -3.81,-7.62; 10 -1.27,-7.62; 11 1.27,-7.62; 12 3.81,-7.62; 13 6.35,-7.62; 14 8.89,-7.62; 15 11.43,-7.62; 16 13.97,-7.62; 17 16.51,-7.62; 18 19.05,-7.62; 19 21.59,-7.62; 20 24.13,-7.62; 21 24.13,7.62; 22 21.59,7.62; 23 19.05,7.62; 24 16.51,7.62; 25 13.97,7.62; 26 11.43,7.62; 27 8.89,7.62; 28 6.35,7.62; 29 3.81,7.62; 30 1.27,7.62; 31 -1.27,7.62; 32 -3.81,7.62; 33 -6.35,7.62; 34 -8.89,7.62; 35 -11.43,7.62; 36 -13.97,7.62; 37 -16.51,7.62; 38 -19.05,7.62; 39 -21.59,7.62; 40 -24.13,7.62
TO220V = drill 1.016 long: 1 -2.54,-2.54; 2 0,-2.54; 3 2.54,-2.54
DIL08 = drill 0.813 long: 1 -3.81,-3.81; 2 -1.27,-3.81; 3 1.27,-3.81; 4 3.81,-3.81; 5 3.81,3.81; 6 1.27,3.81; 7 -1.27,3.81; 8 -3.81,3.81
DCJ0202 = drill 3 pad 3.81: 1 0,3.1; 2 4.8,0; 3 0,-3
2X05 = drill 1.016 octagon: 1 -5.08,-1.27; 2 -5.08,1.27; 3 -2.54,-1.27; 4 -2.54,1.27; 5 0,-1.27; 6 0,1.27; 7 2.54,-1.27; 8 2.54,1.27; 9 5.08,-1.27; 10 5.08,1.27
D01PA-PAD = drill 1.803 pad 2.54: B 0,-1.016
0204/7 = drill 0.813 octagon: 1 -3.81,0; 2 3.81,0
HY-1602F = drill 1 pad 1.93 long: 1 2.54,0; 2 5.08,0; 3 7.62,0; 4 10.16,0; 5 12.7,0; 6 15.24,0; 7 17.78,0; 8 20.32,0; 9 22.86,0; 10 25.4,0; 11 27.94,0; 12 30.48,0; 13 33.02,0; 14 35.56,0; 15 38.1,0; 16 40.64,0 | hole 2.5: -2.96,0; 72.04,0; -2.96,-31; 72.04,-31
LED5MM = drill 0.813 octagon: A -1.27,0; K 1.27,0
1X15 = drill 1.016 long: 1 -17.78,0; 2 -15.24,0; 3 -12.7,0; 4 -10.16,0; 5 -7.62,0; 6 -5.08,0; 7 -2.54,0; 8 0,0; 9 2.54,0; 10 5.08,0; 11 7.62,0; 12 10.16,0; 13 12.7,0; 14 15.24,0; 15 17.78,0
1X09 = drill 1.016 long: 1 -10.16,0; 2 -7.62,0; 3 -5.08,0; 4 -2.54,0; 5 0,0; 6 2.54,0; 7 5.08,0; 8 7.62,0; 9 10.16,0
1X08 = drill 1.016 long: 1 -8.89,0; 2 -6.35,0; 3 -3.81,0; 4 -1.27,0; 5 1.27,0; 6 3.81,0; 7 6.35,0; 8 8.89,0
TC26V = drill 0.813: 1 -1.27,0; 2 1.27,0
CA6V = drill 1.016 long: A -2.54,-2.54; E 2.54,-2.54; S 0,2.54
1X04 = drill 1.016 long: 1 -3.81,0; 2 -1.27,0; 3 1.27,0; 4 3.81,0
1X07 = drill 1.016 long: 1 -7.62,0; 2 -5.08,0; 3 -2.54,0; 4 0,0; 5 2.54,0; 6 5.08,0; 7 7.62,0
TO92 = drill 0.813 octagon: 1 1.27,0; 2 0,1.905; 3 -1.27,0
LED_MOJ = drill 0.6 long: PIN1 -6.35,-7.62; PIN2 -3.81,-7.62; PIN3 -1.27,-7.62; PIN4 1.27,-7.62; PIN5 3.81,-7.62; PIN6 6.35,-7.62; PIN7 6.35,7.62; PIN8 3.81,7.62; PIN9 1.27,7.62; PIN10 -1.27,7.62; PIN11 -3.81,7.62; PIN12 -6.35,7.62
BUZZER_MAT = drill 1: GND 3.8,0; VCC -3.8,0
DIP18 = drill 0.75 long: 1 -2.54,10.16; 2 -2.54,7.62; 3 -2.54,5.08; 4 -2.54,2.54; 5 -2.54,0; 6 -2.54,-2.54; 7 -2.54,-5.08; 8 -2.54,-7.62; 9 -2.54,-10.16; 10 3.81,-10.16; 11 3.81,-7.62; 12 3.81,-5.08; 13 3.81,-2.54; 14 3.81,0; 15 3.81,2.54; 16 3.81,5.08; 17 3.81,7.62; 18 3.81,10.16
PN87520 = drill 0.95 long: 1 -3.5,2.71; 2 -1,2.71; 3 1,2.71; 4 3.5,2.71 | drill 2.8 pad 3.5: P$1 6.57,0; P$2 -6.57,0

### Placement (x,y rotation side)
1/2/3/4/5/6  111.76,15.24 0 top
12/11/10/9/8/7  111.76,77.47 180 top
B/A  173.99,43.18 0 top
BUZZER  124.46,58.42 0 top
C1  43.18,123.19 90 top
C2  45.72,104.14 180 top
C3  49.53,109.22 0 top
C4  30.48,85.09 0 top
C5  26.67,54.61 180 top
C6  25.4,48.26 180 top
C7  32.26,52.32 0 top
C8  32.26,47.5 0 top
C9  73.66,55.88 270 top
C10  67.31,58.42 0 top
C11  67.31,53.34 0 top
C12  123.19,66.04 270 top
C13  130.81,66.04 270 top
C14  138.68,66.04 270 top
C15  146.3,66.04 270 top
C16  153.92,66.04 270 top
C17  161.54,66.04 270 top
C18  142.24,27.94 0 top
CAN_RESET  129.29,18.92 0 top
CAN_RESET_SWITCH  127,29.21 90 top
CAN_VCC  123.19,15.24 270 top
CANT_VCC  161.42,41.91 270 top
ENC  74.93,120.65 0 top
ENCODER  73.66,106.68 270 top
F1  27.94,121.92 0 top
G1  173.99,102.87 0 top
H1  7.62,121.92 0 top
H2  7.62,7.62 0 top
H3  172.72,7.62 0 top
H4  172.72,121.92 0 top
I2C_SCL/SDA  99.06,3.81 180 top
IC1  53.34,54.61 270 top
IC2  53.34,124.46 0 top
IC3  172.72,74.93 180 top
J1  11.43,106.68 270 top
JP1  38.1,52.4 90 top
JP2  38.1,47.5 90 top
KANDA  5.08,22.86 90 top
KK1  53.34,124.46 180 top
L2  80.01,58.42 180 top
LCD  88.9,124.46 0 top
LED1  19.05,19.05 270 top
LED1/LED2  22.86,24.13 180 top
LED2  26.67,19.05 270 top
LED3  34.29,19.05 270 top
LED3/LED4  38.1,24.13 180 top
LED4  41.91,19.05 270 top
LED5  49.53,19.05 270 top
LED5/LED6  53.34,24.13 180 top
LED6  57.15,19.05 270 top
LED7  64.77,19.05 270 top
LED7/LED8  68.58,24.13 180 top
LED8  72.39,19.05 270 top
LISTWA_PINOW_1  6.35,60.96 270 top
LISTWA_PINOW_R_DN  80.01,40.64 270 top
LISTWA_PINOW_R_UP  80.01,69.85 270 top
MCP2551  151.51,33.4 180 top
Q2  175.26,82.55 180 top
R1  96.52,82.55 0 top
R2  30.48,114.3 180 top
R3  19.05,10.16 270 top
R4  26.67,10.16 270 top
R5  34.29,10.16 270 top
R6  41.91,10.16 270 top
R7  29.21,93.98 180 top
R8  80.01,54.99 0 top
R9  49.53,10.16 270 top
R10  57.15,10.16 270 top
R11  64.77,10.16 270 top
R12  72.39,10.16 270 top
R13  115.57,29.21 270 top
R14  113.03,29.21 270 top
R15  110.49,29.21 270 top
R16  107.95,29.21 270 top
R17  105.41,29.21 270 top
R18  118.11,69.85 90 top
R19  110.49,69.85 90 top
R20  105.41,69.85 270 top
R21  139.7,50.8 270 top
R22  130.81,58.42 180 top
R23  64.77,106.68 180 top
R24  119.38,22.86 90 top
R25  115.57,69.85 270 top
R26  113.03,69.85 270 top
R27  107.95,69.85 90 top
R28  64.77,109.22 180 top
R29  64.77,111.76 180 top
R30  135.89,32.51 180 top
RES/CS/SO/SI/SCK/INT/RX0BF/RX1BF  147.32,17.78 180 top
RESET_SWITCH  38.23,84.58 270 top
RO/RE/DE/DI  173.99,24 0 top
RS-485  173.99,33.02 0 top
RS-485_VCC  167.64,41.91 270 top
RS/CH/CL/VREF  151.51,25.53 180 top
RS/RW/E/DB4..DB7  110.49,86.36 180 top
S1  125.48,75.06 270 top
S2  133.1,74.93 270 top
S3  140.97,74.93 270 top
S4  148.59,74.93 270 top
S5  156.21,74.93 270 top
S6  163.83,74.93 270 top
SDA/SCL/SQW_OUT/_RTC  171.45,66.04 0 top
SPI_SCK/MISO/MOSI/SS  83.95,17.78 180 top
SW1_SW2  129.54,83.82 180 top
SW3_SW4  145.03,83.82 180 top
SW5_SW6  160.27,83.82 180 top
T1  119.38,30.48 180 top
T2  116.84,61.34 270 top
T3  103.5,61.47 270 top
T4  111.12,61.34 270 top
T5  139.7,58.42 90 top
TXC/RXC/CLKAOU_SOF/TX0RTS/TX1RTS/TX2RTS/OSC2/OSC1  144.78,3.81 0 top
TXD/RXD  148.97,41.78 180 top
U$1  111.76,45.72 0 top
U$2  148.59,55.88 270 top
U$3  146.05,10.16 90 top
UART_GND/TX/RX/VCC  77.47,3.81 0 top
UART_VCC  88.9,3.81 0 top
VCC_CHECK  21.59,114.3 180 top
VCC_IN  20.32,102.87 270 top
VCC_KANDA  20.32,92.71 270 top
VCC_LCD  81.28,88.9 90 top
VCC_OUT  36.83,100.33 270 top
X2  11.43,90.17 270 top

### Tracks (layer width: path | path; a pad name or v marks a point on that pad's centre or on a via)
AGND
  pour Top (isolate 0.406): 58.42,80.01 58.42,52.07 78.74,52.07 81.28,52.07 81.28,59.69 82.55,59.69 82.55,80.01
AREF
  Top 0.61: C10.1 IC1.32
DB4
  Top 0.61: RS/RW/E/DB4..DB7.4 110.49,97.79 111.76,99.06 115.57,99.06 116.84,100.33 LCD.11
DB5
  Top 0.61: LCD.12 119.38,96.52 118.11,95.25 114.3,95.25 113.03,93.98 RS/RW/E/DB4..DB7.3
DB6
  Top 0.61: LCD.13 121.92,92.71 120.65,91.44 116.84,91.44 115.57,90.17 RS/RW/E/DB4..DB7.2
DB7
  Top 0.61: RS/RW/E/DB4..DB7.1 123.19,86.36 124.46,87.63 LCD.14
E
  Top 0.61: RS/RW/E/DB4..DB7.5 107.95,92.71 106.68,93.98 105.41,93.98 104.14,95.25 LCD.6
GND
  pour Bottom (isolate 0.406): -1.27,130.81 181.61,130.81 181.61,-1.27 -1.27,-1.27
N$1
  Top 1.016: J1.1 VCC_IN.1
N$2
  Bottom 0.61: X2.1 16.2,93.67 17.78,95.25 17.78,97.79 19.05,99.06 VCC_IN.4
N$3
  Top 0.406: U$1.PIN6 T1.1
N$4
  Bottom 0.61: R2.2 VCC_CHECK.A
N$5
  Top 0.61: IC1.30 C11.+ 68.58,55.88 69.85,55.88 72.39,58.42 C9.1 L2.2
N$6
  Top 0.61: RS/CH/CL/VREF.1 MCP2551.8
N$7
  Top 0.61: 12/11/10/9/8/7.6 R20.1
N$8
  Top 0.406: 1/2/3/4/5/6.1 R17.2
N$9
  Top 0.406: 1/2/3/4/5/6.2 R16.2
N$10
  Top 0.406: 1/2/3/4/5/6.3 R15.2
N$11
  Top 0.406: 1/2/3/4/5/6.4 R14.2
N$12
  Top 0.406: 1/2/3/4/5/6.5 R13.2
N$13
  Top 0.406: U$1.PIN1 R17.1
N$14
  Top 0.406: U$1.PIN11 R27.1
N$15
  Top 0.406: R3.1 LED1.K
N$16
  Top 0.61: LED1.A 19.05,22.86 20.32,24.13 LED1/LED2.2
N$17
  Top 0.61: 12/11/10/9/8/7.4 R19.2
N$18
  Top 0.406: R18.1 119.38,66.04 120.65,64.77 120.65,58.42 118.11,55.88 U$1.PIN7
N$19
  Top 0.406: U$1.PIN2 R16.1
N$20
  Top 0.406: U$1.PIN3 R15.1
N$21
  Top 0.406: U$1.PIN4 R14.1
N$22
  Top 0.406: U$1.PIN5 R13.1
N$23
  Top 0.61: 12/11/10/9/8/7.1 R18.2
N$24
  Top 0.61: 12/11/10/9/8/7.2 R25.1
N$25
  Top 0.406: U$1.PIN8 115.57,55.88 116.84,57.15 T2.1
N$26
  Top 0.61: R24.1 119.38,16.51 1/2/3/4/5/6.6
N$27
  Top 0.61: LED2.A 26.67,22.86 25.4,24.13 LED1/LED2.1
N$28
  Top 0.61: LED3.A 34.29,22.86 35.56,24.13 LED3/LED4.2
N$29
  Top 0.61: LED6.A 57.15,22.86 55.88,24.13 LED5/LED6.1
N$30
  Top 0.406: R9.1 LED5.K
N$31
  Top 0.406: R4.1 LED2.K
N$32
  Top 0.406: R10.1 LED6.K
N$33
  Top 0.406: R5.1 LED3.K
N$34
  Top 0.406: R11.1 LED7.K
N$35
  Top 0.406: R6.1 LED4.K
N$36
  Top 0.406: LED8.K R12.1
N$37
  Top 0.61: LED5.A 49.53,22.86 50.8,24.13 LED5/LED6.2
N$38
  Top 0.61: RS/CH/CL/VREF.2 MCP2551.7
N$39
  Top 0.61: LED8.A 72.39,22.86 71.12,24.13 LED7/LED8.1
N$40
  Bottom 0.61: C18.1 133.35,27.94 132.08,29.21 R30.2 129.31,32.51 CAN_RESET_SWITCH.4 CAN_RESET_SWITCH.3 129.29,25.93 CAN_RESET.1
N$41
  Top 0.61: R1.S LCD.3
N$42
  Top 0.61: VCC_KANDA.2 20.32,82.55 19.05,81.28 12.7,81.28 11.43,80.01 8.89,80.01 7.62,81.28 3.81,81.28 2.54,80.01 2.54,33.02 1.32,31.8 1.32,19 2.54,17.78 KANDA.2
N$43
  Top 0.61: RS/CH/CL/VREF.3 MCP2551.6
N$44
  Top 0.61: RS/CH/CL/VREF.4 MCP2551.5
N$46
  Top 0.406: T1.2 R24.2
N$49
  Top 0.61: T2.2 118.75,64.13 118.11,64.77 116.84,64.77 R25.2
N$50
  Top 0.406: T4.1 112.65,60.07 113.03,59.69 U$1.PIN9
N$51
  Top 0.61: 12/11/10/9/8/7.3 R26.1
N$52
  Top 0.61: SDA/SCL/SQW_OUT/_RTC.2 IC3.6
N$53
  Top 0.406: R26.2 T4.2
N$54
  Top 0.61: SDA/SCL/SQW_OUT/_RTC.1 IC3.5
N$55
  Top 0.406: U$1.PIN10 110.49,57.15 109.22,58.42 109.22,63.5 110.49,64.77 R19.1
N$56
  Top 0.61: 12/11/10/9/8/7.5 R27.2
N$57
  Top 0.406: IC3.1 Q2.1
N$58
  Top 0.61: T3.2 R20.2
N$59
  Top 0.406: T3.1 103.5,56.51 105.41,54.61 U$1.PIN12
N$60
  Top 0.406: IC3.2 Q2.2
N$61
  Bottom 0.61: IC3.3 G1.+
N$62
  Top 0.61: T5.1 U$2.VCC
N$63
  Top 0.61: R21.1 T5.3
N$64
  Top 0.61: R22.1 T5.2
N$65
  Top 0.61: BUZZER.1 R22.2
N$68
  Top 0.61: RS-485.4 RO/RE/DE/DI.4
N$69
  Top 0.61: RO/RE/DE/DI.3 RS-485.3
N$70
  Top 0.61: RO/RE/DE/DI.2 RS-485.2
N$71
  Top 0.61: RO/RE/DE/DI.1 RS-485.1
N$72
  Top 0.61: B/A.2 RS-485.6
N$73
  Top 0.61: B/A.1 RS-485.7
N$74
  Top 0.61: R28.1 69.85,109.22 72.39,106.68 ENCODER.2 76.2,106.68 77.47,107.95 77.47,113.11 ENC.B
N$75
  Top 0.61: ENC.A 73.66,111.92 ENCODER.1 71.12,111.76 R29.1
N$76
  Bottom 0.61: CAN_VCC.2 U$3.18
N$77  (via drill 0.75)
  Top 0.61: R23.1 69.85,106.68 72.39,104.14 ENCODER.3 78.74,104.14 80.01,105.41 v80.01,111.76
  Bottom 0.61: v80.01,111.76 80.01,115.57 77.47,118.11 77.47,127.61 ENC.E
N$78
  Top 0.61: RES/CS/SO/SI/SCK/INT/RX0BF/RX1BF.1 U$3.10
N$79
  Top 0.61: U$3.11 RES/CS/SO/SI/SCK/INT/RX0BF/RX1BF.2
N$80
  Top 0.61: U$3.12 RES/CS/SO/SI/SCK/INT/RX0BF/RX1BF.3
N$81
  Top 0.61: U$3.13 RES/CS/SO/SI/SCK/INT/RX0BF/RX1BF.4
N$82
  Top 0.61: U$3.14 RES/CS/SO/SI/SCK/INT/RX0BF/RX1BF.5
N$83
  Top 0.61: U$3.15 RES/CS/SO/SI/SCK/INT/RX0BF/RX1BF.6
N$84
  Top 0.61: U$3.16 RES/CS/SO/SI/SCK/INT/RX0BF/RX1BF.7
N$85
  Top 0.61: U$3.17 RES/CS/SO/SI/SCK/INT/RX0BF/RX1BF.8
N$86
  Top 0.61: TXC/RXC/CLKAOU_SOF/TX0RTS/TX1RTS/TX2RTS/OSC2/OSC1.8 U$3.8
N$87
  Top 0.61: U$3.7 TXC/RXC/CLKAOU_SOF/TX0RTS/TX1RTS/TX2RTS/OSC2/OSC1.7
N$88
  Top 0.61: U$3.6 TXC/RXC/CLKAOU_SOF/TX0RTS/TX1RTS/TX2RTS/OSC2/OSC1.6
N$89
  Top 0.61: U$3.5 TXC/RXC/CLKAOU_SOF/TX0RTS/TX1RTS/TX2RTS/OSC2/OSC1.5
N$90
  Top 0.61: U$3.4 TXC/RXC/CLKAOU_SOF/TX0RTS/TX1RTS/TX2RTS/OSC2/OSC1.4
N$91
  Top 0.61: U$3.3 TXC/RXC/CLKAOU_SOF/TX0RTS/TX1RTS/TX2RTS/OSC2/OSC1.3
N$92
  Top 0.61: TXC/RXC/CLKAOU_SOF/TX0RTS/TX1RTS/TX2RTS/OSC2/OSC1.2 U$3.2
N$93
  Top 0.61: TXC/RXC/CLKAOU_SOF/TX0RTS/TX1RTS/TX2RTS/OSC2/OSC1.1 U$3.1
N$100
  Bottom 0.61: UART_GND/TX/RX/VCC.4 UART_VCC.1
N$101
  Bottom 0.61: MCP2551.2 152.78,39.75 153.67,40.64 CANT_VCC.2
N$102
  Bottom 0.61: F1.2A C1.+ IC2.1
N$103
  Bottom 0.61: RS-485.8 168.91,36.83 167.64,38.1 RS-485_VCC.2
N$104
  Top 0.61: LED4.A 41.91,22.86 40.64,24.13 LED3/LED4.1
N$105
  Top 0.61: LED7.A 64.77,22.86 66.04,24.13 LED7/LED8.2
N$106
  Bottom 0.61: LCD.15 127,127 125.73,128.27 95.25,128.27 93.98,127 LCD.2 93.98,88.9 92.71,87.63 91.44,87.63 | 91.44,87.63 VCC_LCD.1 | R1.A 92.71,80.01 91.44,81.28 91.44,87.63
PINA0
  Top 0.61: IC1.40 LISTWA_PINOW_R_UP.1
PINA1
  Top 0.61: IC1.39 LISTWA_PINOW_R_UP.2
PINA2
  Top 0.61: IC1.38 LISTWA_PINOW_R_UP.3
PINA3
  Top 0.61: IC1.37 LISTWA_PINOW_R_UP.4
PINA4
  Top 0.61: IC1.36 LISTWA_PINOW_R_UP.5
PINA5
  Top 0.61: IC1.35 LISTWA_PINOW_R_UP.6
PINA6
  Top 0.61: IC1.34 LISTWA_PINOW_R_UP.7
PINA7
  Top 0.61: IC1.33 LISTWA_PINOW_R_UP.8
PINB0
  Top 0.61: LISTWA_PINOW_1.1 IC1.1
PINB1
  Top 0.61: IC1.2 LISTWA_PINOW_1.2
PINB2
  Top 0.61: IC1.3 LISTWA_PINOW_1.3
PINB3
  Top 0.61: LISTWA_PINOW_1.4 IC1.4
PINB4
  Top 0.61: LISTWA_PINOW_1.5 IC1.5 55.88,68.58 57.15,67.31 57.15,52.07 58.42,50.8 58.42,30.48 59.69,29.21 86.36,29.21 87.76,27.81 SPI_SCK/MISO/MOSI/SS.1
PINB5
  Top 0.61: LISTWA_PINOW_1.6 IC1.6 | SPI_SCK/MISO/MOSI/SS.2 85.22,7.75 83.82,6.35 83.82,2.54 82.6,1.32 17.73,1.32 16.51,2.54 16.51,15.24 13.97,17.78 KANDA.1
  Bottom 0.61: KANDA.1 12.7,17.78 13.97,19.05 13.97,63.5 12.7,64.77 7.62,64.77 LISTWA_PINOW_1.6
PINB6
  Top 0.61: LISTWA_PINOW_1.7 IC1.7 54.61,63.5 55.88,62.23 55.88,50.8 57.15,49.53 57.15,29.21 58.42,27.94 81.28,27.94 82.68,26.54 SPI_SCK/MISO/MOSI/SS.3
  Bottom 0.61: LISTWA_PINOW_1.7 5.08,63.5 3.81,62.23 3.81,31.75 6.35,29.21 KANDA.9
PINB7
  Top 0.61: LISTWA_PINOW_1.8 IC1.8 53.34,60.96 54.61,59.69 54.61,49.53 55.88,48.26 55.88,27.94 57.15,26.67 78.74,26.67 80.14,25.27 SPI_SCK/MISO/MOSI/SS.4
  Bottom 0.61: KANDA.7 8.89,25.4 10.16,26.67 10.16,59.69 8.89,60.96 LISTWA_PINOW_1.8
PIND0
  Top 0.61: IC1.14 22.86,45.72 21.59,46.99 21.59,57.15 20.32,58.42 LISTWA_PINOW_1.9
  Bottom 0.61: UART_GND/TX/RX/VCC.3 78.74,26.67 77.47,27.94 55.88,27.94 52.07,31.75 52.07,44.45 50.8,45.72 IC1.14
PIND1
  Top 0.61: IC1.15 20.32,43.18 19.05,44.45 19.05,54.61 17.78,55.88 LISTWA_PINOW_1.10
  Bottom 0.61: UART_GND/TX/RX/VCC.2 76.2,25.4 74.93,26.67 54.61,26.67 50.8,30.48 50.8,41.91 49.53,43.18 IC1.15
PIND2
  Top 0.61: IC1.16 17.78,40.64 16.51,41.91 16.51,52.07 15.24,53.34 LISTWA_PINOW_1.11
PIND3
  Top 0.61: LISTWA_PINOW_1.12 12.7,50.8 13.97,49.53 13.97,39.37 15.24,38.1 IC1.17
PIND4
  Top 0.61: IC1.18 12.7,35.56 11.43,36.83 11.43,46.99 10.16,48.26 LISTWA_PINOW_1.13
PIND5
  Top 0.61: LISTWA_PINOW_1.14 7.62,45.72 8.89,44.45 8.89,34.29 10.16,33.02 IC1.19
PIND6
  Top 0.61: LISTWA_PINOW_1.15 6.35,31.75 7.62,30.48 IC1.20
PINDC0
  Bottom 0.61: IC1.21 LISTWA_PINOW_R_DN.9
PINDC1
  Top 0.61: I2C_SCL/SDA.2 97.79,31.75 96.52,33.02 LISTWA_PINOW_R_DN.8
  Bottom 0.61: IC1.22 LISTWA_PINOW_R_DN.8
PINDC2
  Top 0.61: I2C_SCL/SDA.1 100.33,34.29 99.06,35.56 LISTWA_PINOW_R_DN.7
  Bottom 0.61: IC1.23 LISTWA_PINOW_R_DN.7
PINDC3
  Bottom 0.61: IC1.24 LISTWA_PINOW_R_DN.6
PINDC4
  Bottom 0.61: IC1.25 LISTWA_PINOW_R_DN.5
PINDC5
  Bottom 0.61: IC1.26 LISTWA_PINOW_R_DN.4
PINDC6
  Bottom 0.61: LISTWA_PINOW_R_DN.3 IC1.27
PINDC7
  Bottom 0.61: IC1.28 LISTWA_PINOW_R_DN.2
PINDC8
  Bottom 0.61: LISTWA_PINOW_R_DN.1 IC1.29
R/W
  Top 0.61: LCD.5 101.6,92.71 102.87,91.44 104.14,91.44 105.41,90.17 RS/RW/E/DB4..DB7.6
RESET  (via drill 1)
  Top 0.61: v29.21,58.42 IC1.9 48.26,58.42 49.53,57.15 49.53,30.48 48.26,29.21 12.7,29.21 11.43,27.94 11.43,24.13 10.16,22.86 KANDA.5
  Bottom 0.61: 25.4,81.28 25.4,59.69 26.67,58.42 v29.21,58.42 | RESET_SWITCH.3 RESET_SWITCH.4 35.92,81.28 25.4,81.28 | 25.4,85.09 25.4,81.28 | 25.4,85.09 R7.2 | C4.1 25.4,85.09
RS
  Top 0.61: RS/RW/E/DB4..DB7.7 102.87,88.9 101.6,90.17 100.33,90.17 99.06,91.44 LCD.4
RXD
  Top 0.61: MCP2551.4 TXD/RXD.2
SQW/OUT
  Top 0.61: SDA/SCL/SQW_OUT/_RTC.3 IC3.7
SWITCH1
  Top 0.61: SW1_SW2.2 124.46,83.82 123.22,82.57 S1.3 S1.4 123.22,68.6 C12.1
SWITCH5
  Top 0.61: SW1_SW2.1 130.81,78.21 S2.3 S2.4 130.84,68.6 C13.1
SWITCH6
  Top 0.61: SW3_SW4.2 139.7,83.82 138.71,82.83 S3.3 S3.4 138.71,68.6 C14.1
SWITCH7
  Top 0.61: SW3_SW4.1 146.3,78.21 S4.3 146.33,71.12 | 146.33,71.12 S4.4 | 146.33,71.12 146.33,68.6 C15.1
SWITCH8
  Top 0.61: C16.1 153.95,68.6 S5.4 S5.3 153.95,82.83 154.94,83.82 SW5_SW6.2
SWITCH9
  Top 0.61: SW5_SW6.1 161.54,78.21 S6.3 S6.4 161.57,68.6 C17.1
TXD
  Top 0.61: MCP2551.1 155.32,40.26 153.67,41.91 150.37,41.91 TXD/RXD.1
VCC
  Bottom 0.406: CAN_VCC.1 123.19,45.72
  Bottom 0.61: 43.18,55.88 41.91,54.61 C5.+ C6.1 | VCC_IN.3 22.86,101.6 | 46.99,101.6 43.18,101.6 | 40.64,101.6 43.18,101.6 | 40.64,101.6 VCC_OUT.1 | 73.66,99.06 59.69,99.06 | 73.66,99.06 80.01,99.06 81.28,97.79 VCC_LCD.2 | 59.69,99.06 59.69,105.41 | 59.69,105.41 R23.2 | 59.69,105.41 59.69,107.95 | 59.69,107.95 R28.2 | 59.69,107.95 59.69,110.49 R29.2 | 88.9,62.74 90.17,62.74 | 88.9,62.74 88.39,62.74 86.36,64.77 86.36,81.28 85.09,82.55 74.93,82.55 73.66,83.82 73.66,99.06 | 95.25,62.74 90.17,62.74 | 95.25,62.74 T3.3 111,62.74 T4.3 T2.3 | 95.25,62.74 95.25,48.26 97.79,45.72 120.65,45.72 | 120.65,45.72 123.19,45.72 139.7,45.72 | IC3.8 176.53,48.26 173.99,45.72 167.64,45.72 | 161.29,45.72 139.7,45.72 | 161.29,45.72 167.64,45.72 | 43.18,55.88 43.18,101.6 | UART_VCC.2 90.17,62.74 | T1.3 120.65,45.72 | R21.2 139.7,45.72 | R30.1 139.7,45.72 | RS-485_VCC.1 167.64,45.72 | 43.18,55.88 IC1.10 | L2.1 87.63,58.42 88.9,59.69 88.9,62.74 | 40.64,101.6 40.64,95.25 39.37,93.98 R7.1 | VCC_KANDA.1 21.59,93.98 22.86,95.25 22.86,101.6 | R2.1 41.91,114.3 44.45,111.76 46.99,111.76 | 46.99,101.6 46.99,100.33 48.26,99.06 59.69,99.06 | 22.86,101.6 30.48,101.6 31.75,102.87 31.75,109.22 33.02,110.49 46.99,110.49 | IC2.3 55.88,113.03 54.61,111.76 46.99,111.76 | 46.99,110.49 46.99,111.76 | 46.99,110.49 C3.1 C2.+ 46.99,101.6 | CANT_VCC.1 161.42,45.59 161.29,45.72
VIN
  Bottom 0.813: VCC_IN.2 19.05,104.14 17.78,105.41 17.78,115.57 16.51,116.84 16.51,120.9 F1.1A
XTAL1
  Top 0.61: IC1.13 44.96,47.5 JP2.1 C8.2
XTAL2
  Top 0.61: IC1.12 44.12,52.4 JP1.1 34.87,52.4 C7.2

### Text on the board
tPlace: Created by / Mateusz Michalski
tNames: PBO | PA0 | PB1 | PA1 | PB2 | PA2 | PB3 | PA3 | PB4 | PA4 | PB5 | PA5 | PB6 | PA6 | PB7 | PA7 | PD0 | PD1 | PD2 | PD3 | PC6 | PD4 | PC6 | PD5 | PC5 | PD6 | PC4 | PC3 | PC2 | PC1 | PC0 | PD7